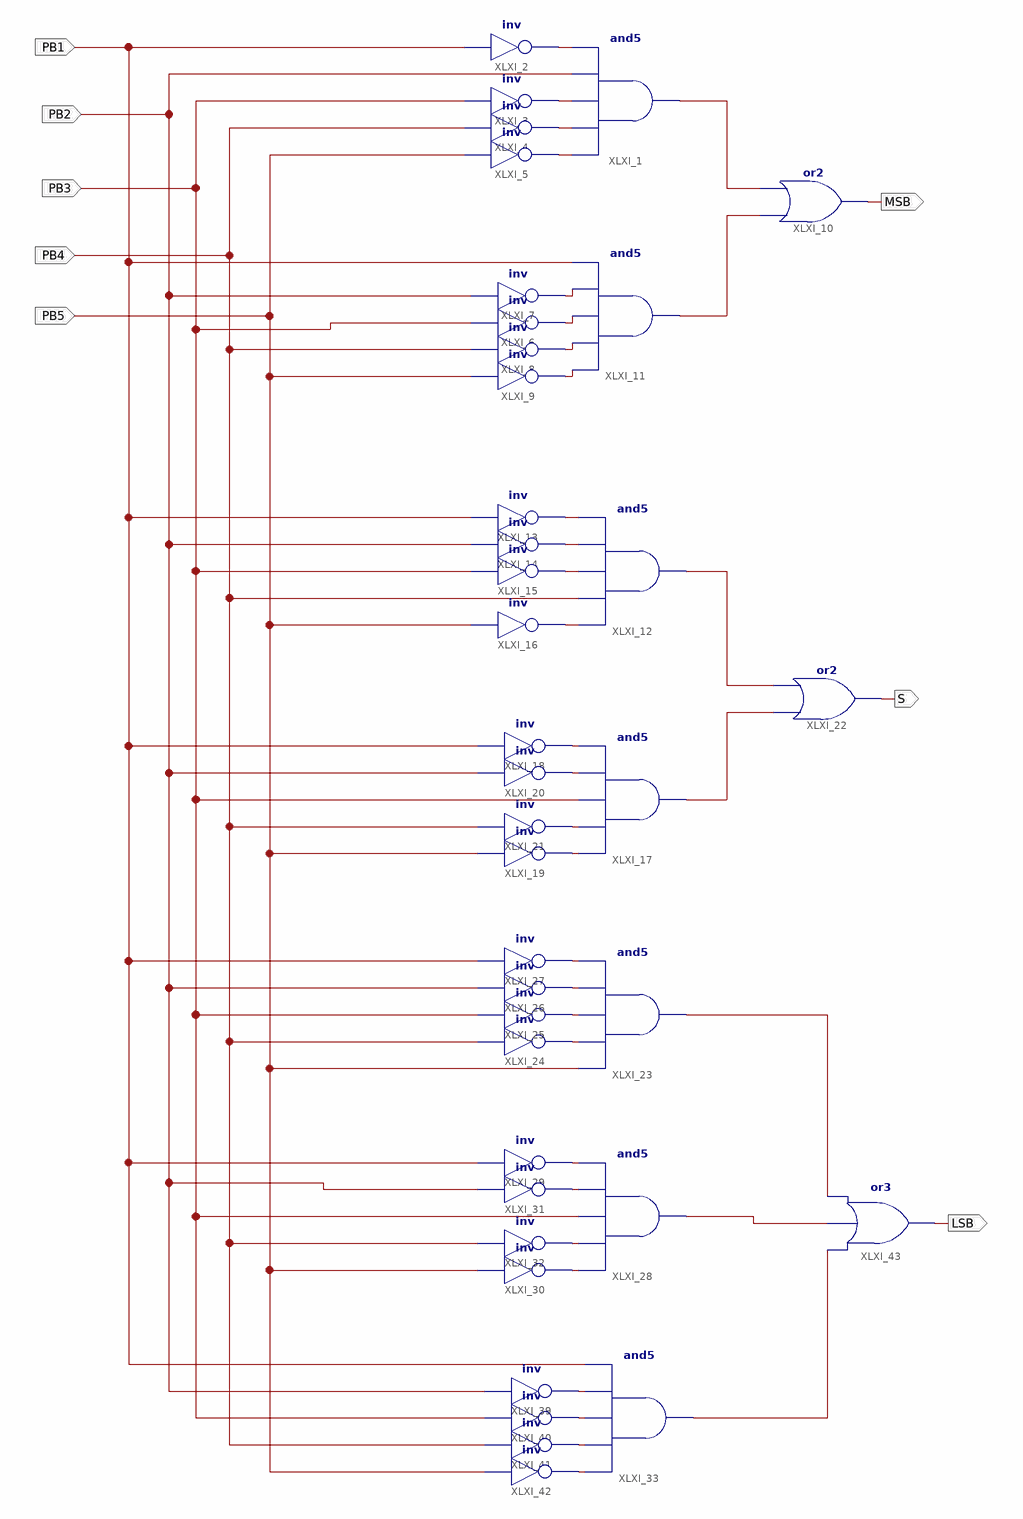
[diagram p0: schematic sheet 1]
// Xilinx ISE schematic encoder5_3.sch (spartan6) as structural Verilog: 38 symbols, 8 ports
module encoder5_3 (
  input  PB1,
  input  PB2,
  input  PB3,
  input  PB4,
  input  PB5,
  output MSB,
  output S,
  output LSB
);

  wire XLXN_1, XLXN_2, XLXN_3, XLXN_4, XLXN_5, XLXN_6, XLXN_7, XLXN_8, XLXN_9, XLXN_10, XLXN_11, XLXN_12,
       XLXN_13, XLXN_14, XLXN_15, XLXN_16, XLXN_17, XLXN_18, XLXN_19, XLXN_20, XLXN_21, XLXN_22, XLXN_23,
       XLXN_24, XLXN_25, XLXN_26, XLXN_27, XLXN_28, XLXN_29, XLXN_30, XLXN_31, XLXN_32, XLXN_51, XLXN_52,
       XLXN_53;

  and XLXI_1 (XLXN_9, XLXN_4, XLXN_3, XLXN_2, PB2, XLXN_1);
  not XLXI_2 (XLXN_1, PB1);
  not XLXI_3 (XLXN_2, PB3);
  not XLXI_4 (XLXN_3, PB4);
  not XLXI_5 (XLXN_4, PB5);
  not XLXI_6 (XLXN_6, PB3);
  not XLXI_7 (XLXN_5, PB2);
  not XLXI_8 (XLXN_8, PB4);
  not XLXI_9 (XLXN_7, PB5);
  or XLXI_10 (MSB, XLXN_10, XLXN_9);
  and XLXI_11 (XLXN_10, XLXN_7, XLXN_8, XLXN_6, XLXN_5, PB1);
  and XLXI_12 (XLXN_19, XLXN_14, PB4, XLXN_13, XLXN_12, XLXN_11);
  not XLXI_13 (XLXN_11, PB1);
  not XLXI_14 (XLXN_12, PB2);
  not XLXI_15 (XLXN_13, PB3);
  not XLXI_16 (XLXN_14, PB5);
  and XLXI_17 (XLXN_20, XLXN_16, XLXN_15, PB3, XLXN_17, XLXN_18);
  not XLXI_18 (XLXN_18, PB1);
  not XLXI_19 (XLXN_16, PB5);
  not XLXI_20 (XLXN_17, PB2);
  not XLXI_21 (XLXN_15, PB4);
  or XLXI_22 (S, XLXN_20, XLXN_19);
  and XLXI_23 (XLXN_51, PB5, XLXN_24, XLXN_23, XLXN_22, XLXN_21);
  not XLXI_24 (XLXN_24, PB4);
  not XLXI_25 (XLXN_23, PB3);
  not XLXI_26 (XLXN_22, PB2);
  not XLXI_27 (XLXN_21, PB1);
  and XLXI_28 (XLXN_52, XLXN_28, XLXN_27, PB3, XLXN_26, XLXN_25);
  not XLXI_29 (XLXN_25, PB1);
  not XLXI_30 (XLXN_28, PB5);
  not XLXI_31 (XLXN_26, PB2);
  not XLXI_32 (XLXN_27, PB4);
  and XLXI_33 (XLXN_53, XLXN_32, XLXN_31, XLXN_30, XLXN_29, PB1);
  not XLXI_40 (XLXN_30, PB3);
  not XLXI_39 (XLXN_29, PB2);
  not XLXI_41 (XLXN_31, PB4);
  not XLXI_42 (XLXN_32, PB5);
  or XLXI_43 (LSB, XLXN_53, XLXN_52, XLXN_51);
endmodule
